# Altium schematic sheet Схема питания.SchDoc
size 209 x 297 mm; Address1: Address1; Address2: Address2; Address3: Address3; Address4: Address4; DocumentNumber: АБВГ.123456.001 Э3; SheetNumber: 1; Scale: 1:1; DocumentType: Схема электрическая принципиальная; FirstReferrence: АБВГ.123456.001; Обозначение документа: АБВГ.123456.001 Э3
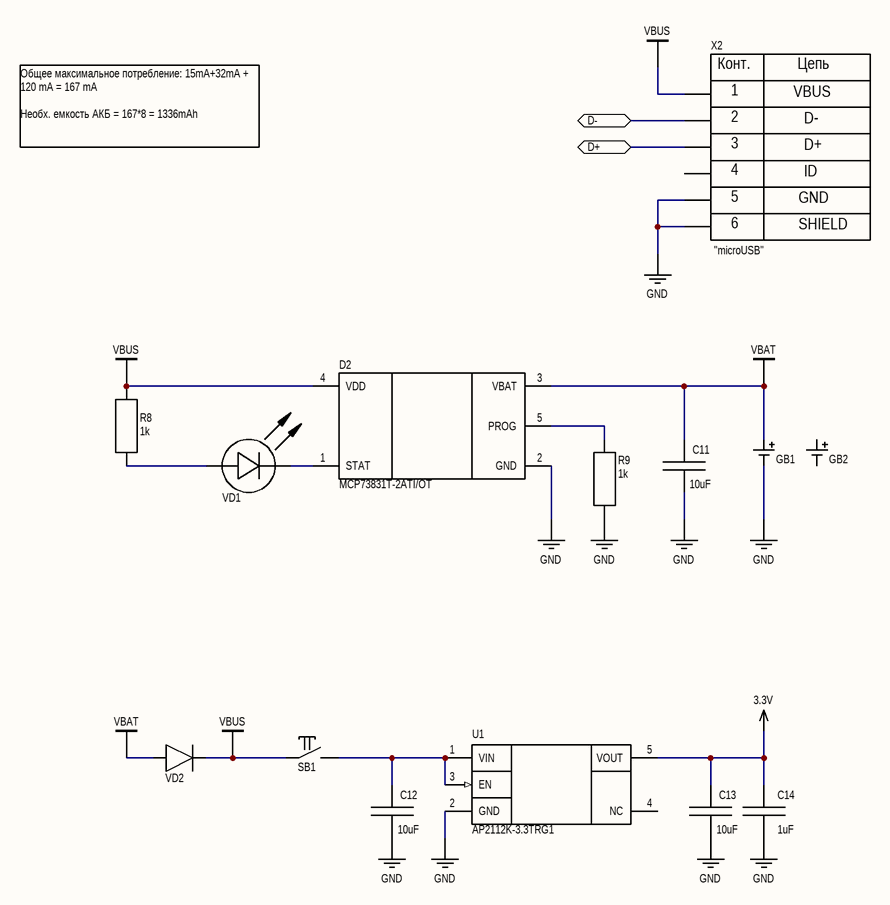
[diagram p0: Схема питания.SchDoc]

## Parts
C11  10uF  [CH1206C]
C12  10uF  [CH1206C]
C13  10uF  [CH1206C]
C14  1uF  [CH0603C]
D2  MCP73831T-2ATI/OT  [SOT23-5]
GB1  1-12 шт., перезаряжаемые литий-полимерные аккумуляторы 3,7 в, 1260100 мАч  [BAT: 34.5X52MM (only pads)]  (value not drawn)
GB2  LP103450JH+PCM+PTC+2 WIRES 70MM  [BAT: 34.5X52MM]  (value not drawn)
R8  1k  [CH0603R]
R9  1k  [CH0603R]
SB1  "Кнопка"  [BUT: 2PADS 2x2mm]  (value not drawn)
U1  AP2112K-3.3TRG1  [SOT-25]
VD1  *  [CH0603LR]  (value not drawn)
VD2  BAT54XV2T1G  [SOD523]  (value not drawn)
X2  "microUSB"  [CON: MicroUSB - TH]

## Ports
D+ (bidir), D- (bidir)

## Nets
3.3V: C13.1 C14.1 U1.5(VOUT)
GND: C11.2 C12.2 C13.2 C14.2 D2.2(GND) GB1.2(-) R9.1 U1.2(GND) X2.5 X2.6
VBAT: C11.1 D2.3(VBAT) GB1.1(+) VD2.1
VBUS: D2.4(VDD) R8.2 SB1.1 VD2.2 X2.1
D+: X2.3 ; port D+
D-: X2.2 ; port D-
NetC12_1: C12.1 SB1.2 U1.1(VIN) U1.3(EN)
NetD2_1: D2.1(STAT) VD1.2(C)
NetD2_5: D2.5(PROG) R9.2
NetR8_1: R8.1 VD1.1(A)

Not connected (* = marked no-connect by the designer): GB2 1(+) 2(-); U1 4(NC); X2 4

## Notes on the sheet
- Общее максимальное потребление: 15mA+32mA + 120 mA = 167 mA
  Необх. емкость АКБ = 167*8 = 1336mAh
- Подп. и дата
- Инв. № дубл.
- Взам. инв. №
- Инв. № подл.
- Изм.
- Лист
- № докум.
- Подп.
- Дата
- Копировал
- Формат А4
- (in symbol USB - micro AB) Конт.; Цепь; VBUS; D-; D+; ID; GND; SHIELD

## Library data of the parts
C11-C13 = Capacitor: CAP CER 10UF 16V X7R 1206; Manufacturer: Murata Electronics; Model: GCM31CR71C106KA64K; HelpURL: https://www.digikey.com/en/products/detail/murata-electronics/GCM31CR71C106KA64K/2592432?s=N4IgTCBcDaIOIGECyBmAjAgSgdg2gDAGwDSAgoQCzEgC6AvkA; ComponentKind: 1206 (3216 Metric); Value: 10uF; Supplier 1: Digi-Key; Supplier Part Number 1: 490-14746-1-ND
C14 = Capacitor: Manufacturer: Samsung Electro-Mechanics; Model: CL10B105KP8NNNC; HelpURL: https://www.digikey.com/en/products/detail/samsung-electro-mechanics/CL10B105KP8NNNC/3887604; ComponentKind: 0603 (1608 Metric); Value: 1uF; Supplier 1: Digi-Key; Supplier Part Number 1: 1276-1946-1-ND
D2 = MCP73831T-2ATI/OT: Li-ion chargers; Manufacturer: Microchip Technology; Model: MCP73831T-2ATI/OT; ComponentKind: SOT23-5; HelpURL: https://www.digikey.com/en/products/detail/microchip-technology/MCP73831T-2ATI-OT/964303; Supplier 1: Digi-Key; Supplier Part Number 1: MCP73831T-2ATI/OTCT-ND
GB1 = Battery_1CELL: Manufacturer: AliExpress; Model: 1-12 шт., перезаряжаемые литий-полимерные аккумуляторы 3,7 в, 1260100 мАч; HelpURL: https://aliexpress.ru/item/1005002756145305.html?srcSns=sns_More&businessType=ProductDetail&spreadType=socialShare&tt=MG&sku_id=12000021992697124; ComponentKind: smd
GB2 = LP103450JH+PCM+PTC+2 WIRES 70MM: LiPo Battery; Manufacturer: Jauch Quartz; Model: LP103450JH+PCM+PTC+2 WIRES 70MM; HelpURL: https://www.digikey.com/en/products/detail/jauch-quartz/LP103450JH-PCM-PTC-2-WIRES-70MM/9560994; ComponentKind: *; Supplier 1: Digi-Key; Supplier Part Number 1: 1908-LP103450JH+PCM+PTC+2WIRES70MM-ND
R8 R9 = Resistor: Manufacturer: YAGEO; Model: RC0603FR-071KL; HelpURL: https://www.digikey.com/en/products/detail/yageo/RC0603FR-071KL/726843; ComponentKind: 0603 (1608 Metric); Value: 1k; Supplier 1: Digi-Key; Supplier Part Number 1: 311-1.00KHRCT-ND
SB1 = Tactile switches: Manufacturer: CW Industries; Model: GRB112B802BR1; HelpURL: https://www.digikey.com/en/products/detail/cw-industries/GRB112B802BR1/2349683; ComponentKind: https://www.digikey.com/en/products/detail/cw-industries/GRB112B802BR1/2349683; Supplier 1: Digi-Key; Supplier Part Number 1: CW103-ND
U1 = AP2112K-3.3TRG1: IC REG LINEAR 3.3V 600MA SOT25; Manufacturer: Diodes Incorporated; Model: AP2112K-3.3TRG1; HelpURL: https://www.digikey.com/en/products/detail/diodes-incorporated/AP2112K-3-3TRG1/4470746; ComponentKind: SOT-25; ComponentLink1Description: HelpURL; ComponentLink1URL: https://www.digikey.com/en/products/detail/diodes-incorporated/AP61100Z6-7/11696569; Supplier 1: Digi-Key; Supplier Part Number 1: AP2112K-3.3TRG1DICT-ND
VD1 = LED: Manufacturer: Lite-On Inc.; Model: LTST-C191KRKT; HelpURL: https://www.digikey.com/en/products/detail/liteon/LTST-C191KRKT/386837; ComponentKind: 0603 (1608 Metric); Value: *; Supplier 1: Digi-Key; Supplier Part Number 1: 160-1447-1-ND
VD2 = Diod: Manufacturer: onsemi; ComponentKind: SOD-523; Model: BAT54XV2T1G; HelpURL: https://www.digikey.com/en/products/detail/onsemi/BAT54XV2T1G/918321; Supplier 1: Digi-Key; Supplier Part Number 1: BAT54XV2T1GOSCT-ND
X2 = USB - micro AB: USB; Manufacturer: Molex; Model: 1050170001; HelpURL: https://www.digikey.com/en/products/detail/molex/1050170001/2350832?s=N4IgTCBcDaIDoBcCMAGArCpB2AtC-SIAugL5A; Supplier 1: Digi-Key; Supplier Part Number 1: WM1399CT-ND